# EAGLE design LOGICA NAO (EAGLE 9.5.2)
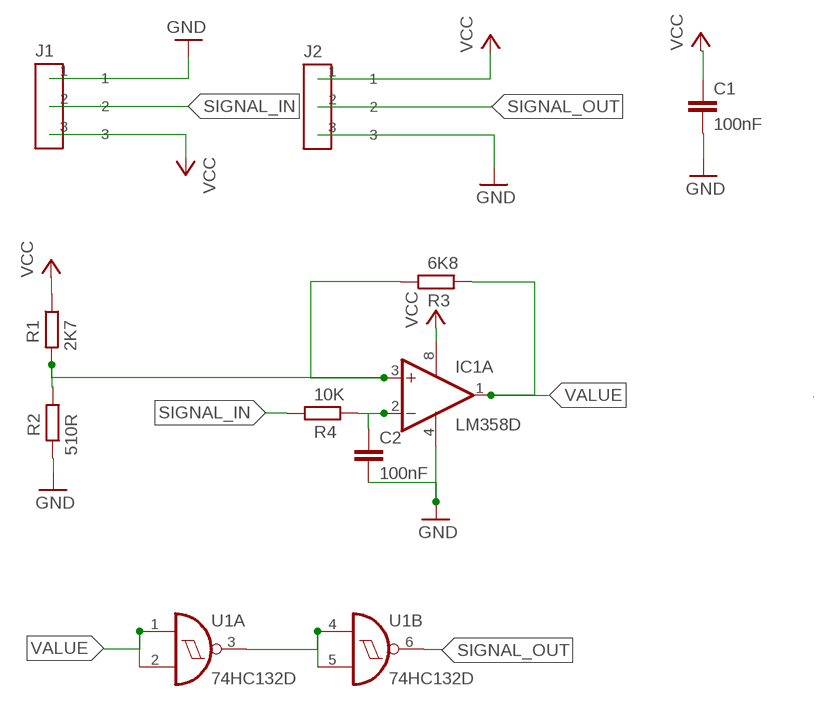
[diagram p0: schematic, sheet 1]

## Parts
C1  100nF  C-EUC0805  [C0805]
C2  100nF  C-EUC0805  [C0805]
IC1  LM358D  [SO08]
J1  CONECTOR_MACHO  [3CONECTOR]
J2  CONECTOR_FEMEA  [3CONECTOR]
R1  2K7  R-EU_R0805W  [R0805W]
R2  510R  R-EU_R0805W  [R0805W]
R3  6K8  R-EU_R0805W  [R0805W]
R4  10K  R-EU_R0805W  [R0805W]
U1  74HC132D  [SO14]

## Nets
GND: C1.2 C2.2 IC1.4(P:V-) J1.1 J2.3 R2.2
N$3: C2.1 IC1.2(A:-IN) R4.2
N$4: U1.3(A:O) U1.4(B:I0) U1.5(B:I1)
N$5: IC1.3(A:+IN) R1.2 R2.1 R3.1
SIGNAL_IN: J1.2 R4.1
SIGNAL_OUT: J2.2 U1.6(B:O)
VALUE: IC1.1(A:OUT) R3.2 U1.1(A:I0) U1.2(A:I1)
VCC: C1.1 IC1.8(P:V+) J1.3 J2.1 R1.1
Unconnected: IC1.5(B:+IN) IC1.6(B:-IN) IC1.7(B:OUT) U1.8(C:O) U1.9(C:I0) U1.10(C:I1) U1.11(D:O) U1.12(D:I0) U1.13(D:I1)

## Power pins joined to a net without a drawn wire
GND: U1.7(P:GND)
VCC: U1.14(P:VCC)

## Library data of the parts
C1 C2 = rcl:C-EU: CAPACITOR, European symbol; SPICEPREFIX: C
IC1 = linear:LM358: OP AMP also LM158; LM258; LM2904 Source: http://cache.national.com/ds/LM/LM158.pdf
J1 = Eletroblocks Lib:CONECTOR_MACHO
J2 = Eletroblocks Lib:CONECTOR_FEMEA
R1-R4 = rcl:R-EU_: RESISTOR, European symbol; SPICEPREFIX: R
U1 = 74xx-eu:74*132: Quad 2-input NAND schmitt trigger

## Board
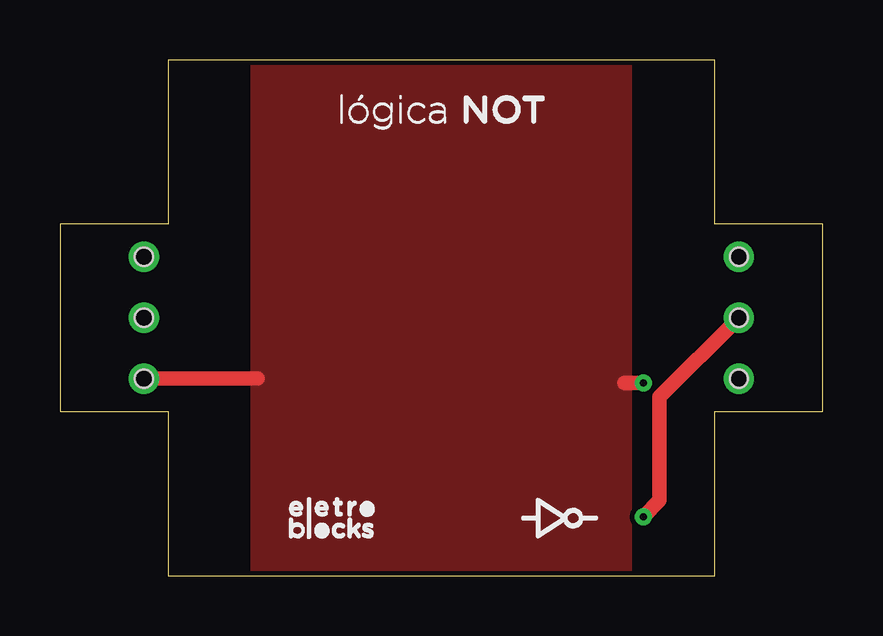
[diagram p1: board, top side]
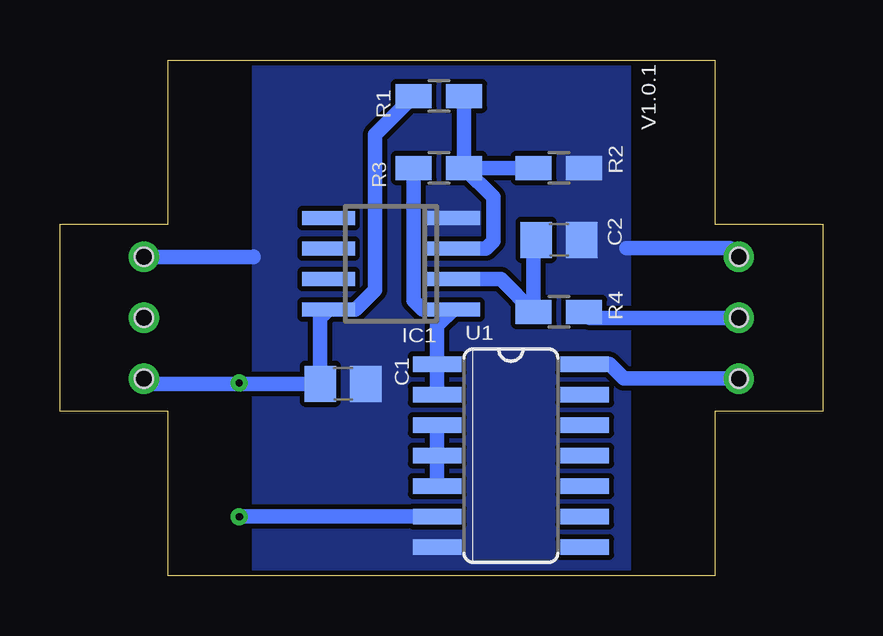
[diagram p2: board, bottom side, seen from below]

Size 31.8 x 21.5 mm. Coordinates in mm from the lower left corner, seen from the top.
Outline: 4.5,0 27.3,0 27.3,6.85 31.8,6.85 31.8,14.65 27.3,14.65 27.3,21.5 4.5,21.5 4.5,14.65 0,14.65 0,6.85 4.5,6.85 4.5,0
Copper layers (1*16): Top 0.035mm / dielectric 1.5mm / Bottom 0.035mm
Design rules "ELETROBLOCKS RULES *": minimum track width 8mil, minimum drill 0.35mm, track to track 8mil, track to pad 8mil, pad to pad 8mil, via to via 8mil, smd to smd 8mil, copper to edge 8mil, drill to drill 8mil, minimum pad ring 10mil, minimum via ring 8mil, stop-mask expansion 4mil, vias tented up to drill 3mm, thermal gap 0mil

### Footprints (pad centres in the part's own frame; a part is rotated, then mirrored left to right if it is on the bottom)
C0805 = smd 1.3 x 1.5: 1 -0.95,0; 2 0.95,0
SO08 = smd 0.6 x 2.2: 1 -1.905,-2.6; 2 -0.635,-2.6; 3 0.635,-2.6; 4 1.905,-2.6; 5 1.905,2.6; 6 0.635,2.6; 7 -0.635,2.6; 8 -1.905,2.6
3CONECTOR = drill 0.75: 1 0,2.54; 2 0,0; 3 0,-2.54 | hole 0.75: 0,2.54; 0,0; 0,-2.54
R0805W = smd 1.5 x 1: 1 -1.052,0; 2 1.052,0
SO14 = smd 0.66 x 2.032: 1 -3.81,-3.073; 2 -2.54,-3.073; 3 -1.27,-3.073; 4 0,-3.073; 5 1.27,-3.073; 6 2.54,-3.073; 7 3.81,-3.073; 8 3.81,3.073; 9 2.54,3.073; 10 1.27,3.073; 11 0,3.073; 12 -1.27,3.073; 13 -2.54,3.073; 14 -3.81,3.073

### Placement (x,y rotation side)
C1  20,8 0 bottom
C2  11,14 0 bottom
IC1  18,13 90 bottom
J1  3.5,10.75 0 top
J2  28.3,10.75 180 top
R1  16,20 0 bottom
R2  11,17 0 bottom
R3  16,17 180 bottom
R4  11,11 180 bottom
U1  13,5 270 bottom

### Tracks (layer width: path | path; a pad name or v marks a point on that pad's centre or on a via)
GND
  Bottom 0.61: J2.3 23.73,13.29 23.72,13.3 | J1.1 3.87,13.65 8.18,13.65
  pour Bottom: 8,0 23.8,0 23.8,21.5 8,21.5
N$3
  Bottom 0.61: C2.1 12.05,13.9 R4.2 13.42,12.37 IC1.2
N$4
  Bottom 0.61: U1.3 U1.4 U1.5
N$5
  Bottom 0.61: R2.1 R3.1 | R3.1 13.72,15.78 13.72,13.94 14.03,13.63 IC1.3 | R3.1 R1.2
SIGNAL_IN
  Bottom 0.61: J1.2 9.7,10.75 R4.1
SIGNAL_OUT  (via drill 0.3)
  Top 0.61: J2.2 25,7.45 25,3.13 v24.32,2.45
  Bottom 0.61: U1.6 v24.32,2.46 v24.32,2.45
VALUE
  Bottom 0.61: U1.2 U1.1 16.07,10.42 IC1.1 16.68,11.1 17.05,11.47 R3.2
VCC  (via drill 0.3)
  Top 0.61: J1.3 8.24,8.21 8.25,8.21 | v24.33,8.03 23.55,8.03 23.54,8.04
  Bottom 0.61: J1.3 8.28,8.21 8.89,8.82 9.92,8.82 U1.14 | R1.1 18.67,18.38 18.67,11.91 19.49,11.1 IC1.8 20.95,10.74 C1.1 24.36,8 | J2.1 28.09,8 24.36,8 | 24.36,8 v24.33,8.03
  pour Top: 8,0 8,21.37 8.11,21.48 23.72,21.48 23.79,21.41 23.79,0

### Text on the board
bPlace: V1.0.1